# Altium project PCB_Project.PrjPcb
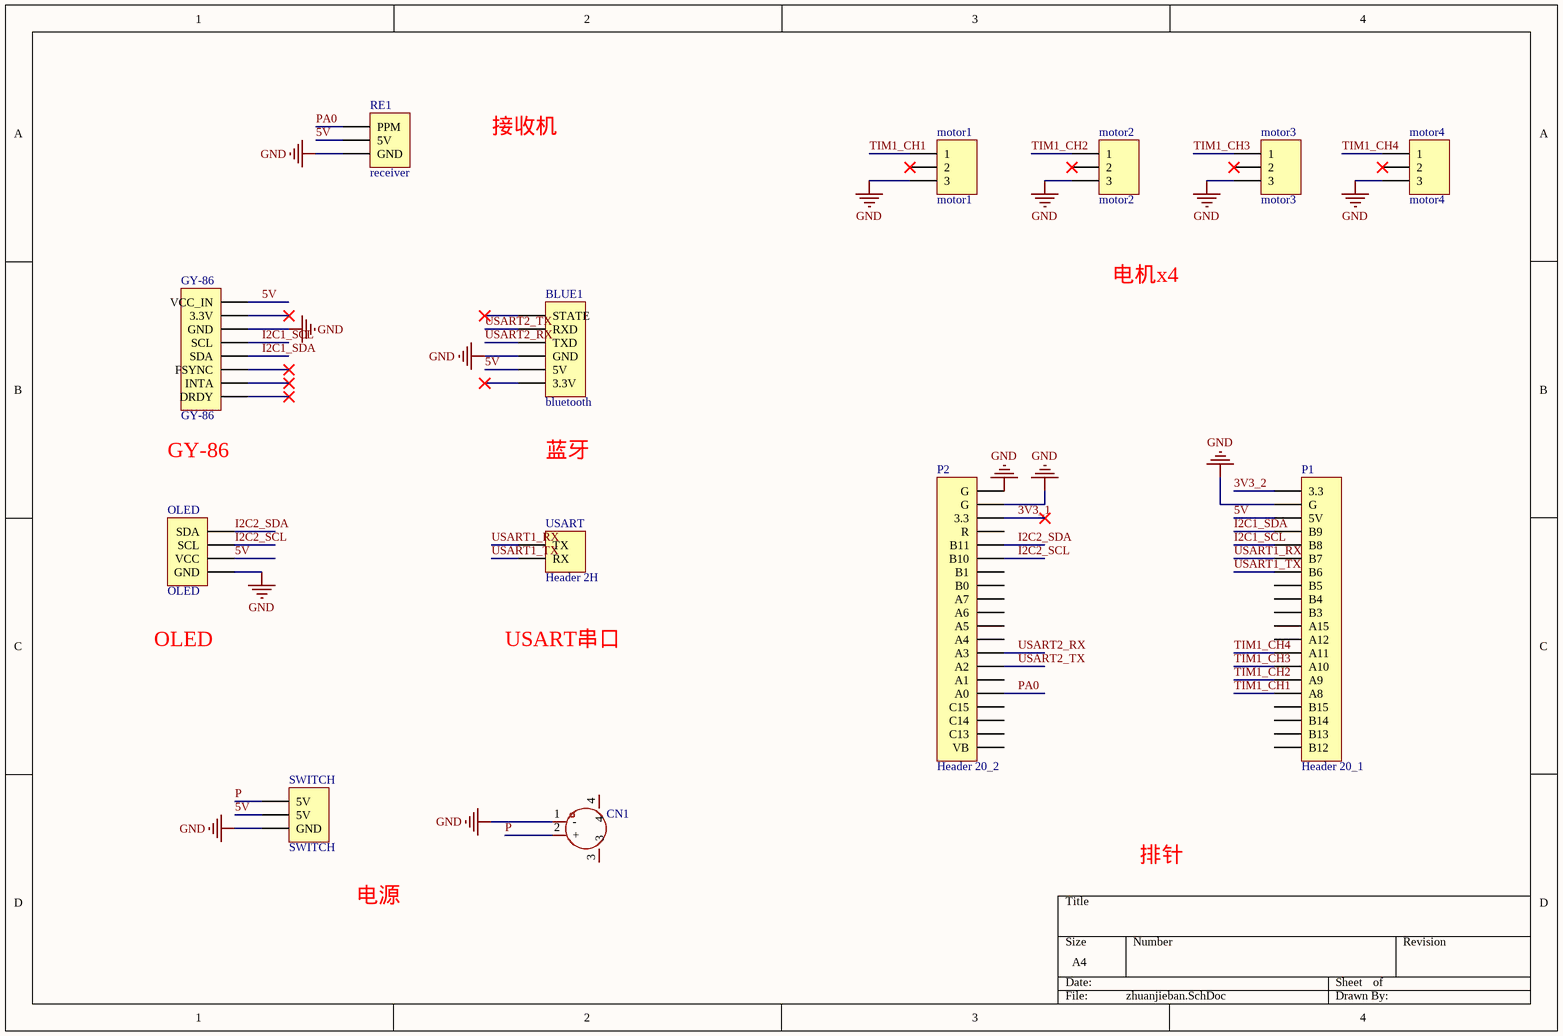
[diagram p0: zhuanjieban.SchDoc]
1 sheet, 13 parts. Net scope: global (net labels, ports and power ports of the same name join across sheets).
Board file: PCB_fin.PcbDoc

## Sheet zhuanjieban.SchDoc
size A4; SheetNumber: 1; SheetTotal: 1

### Parts
BLUE1  bluetooth  [HDR1X6]
CN1  (no value)  [PCBComponent_1]
GY-86  GY-86  [HDR1X8]
motor1  motor1  [HDR1X3]
motor2  motor2  [HDR1X3]
motor3  motor3  [HDR1X3]
motor4  motor4  [HDR1X3]
OLED  OLED  [HDR1X4]
P1  Header 20_1  [HDR1X20]
P2  Header 20_2  [HDR1X20]
RE1  receiver  [HDR1X3]
SWITCH  SWITCH  [HDR1X3]
USART  Header 2H  [HDR1X2H]

### Nets
GND: BLUE1.4(GND) CN1.1(-) GY-86.6(GND) motor1.3 motor2.3 motor3.3 motor4.3 OLED.1(GND) P1.2(G) P2.19(G) P2.20(G) RE1.3(GND) SWITCH.3(GND)
3V3_1: P2.18(3.3)
3V3_2: P1.1(3.3)
5V: BLUE1.5(5V) GY-86.8(VCC_IN) OLED.2(VCC) P1.3(5V) RE1.2(5V) SWITCH.2(5V)
I2C1_SCL: GY-86.5(SCL) P1.5(B8)
I2C1_SDA: GY-86.4(SDA) P1.4(B9)
I2C2_SCL: OLED.3(SCL) P2.15(B10)
I2C2_SDA: OLED.4(SDA) P2.16(B11)
P: CN1.2(+) SWITCH.1(5V)
PA0: P2.5(A0) RE1.1(PPM)
TIM1_CH1: motor1.1 P1.16(A8)
TIM1_CH2: motor2.1 P1.15(A9)
TIM1_CH3: motor3.1 P1.14(A10)
TIM1_CH4: motor4.1 P1.13(A11)
USART1_RX: P1.6(B7) USART.1(TX)
USART1_TX: P1.7(B6) USART.2(RX)
USART2_RX: BLUE1.3(TXD) P2.8(A3)
USART2_TX: BLUE1.2(RXD) P2.7(A2)

Not connected (* = marked no-connect by the designer): BLUE1 1(STATE)* 6(3.3V)*; CN1 3 4; GY-86 1(DRDY)* 2(INTA)* 3(FSYNC)* 7(3.3V)*; motor1 2*; motor2 2*; motor3 2*; motor4 2*; P1 8(B5) 9(B4) 10(B3) 11(A15) 12(A12) 17(B15) 18(B14) 19(B13) 20(B12); P2 1(VB) 2(C13) 3(C14) 4(C15) 6(A1) 9(A4) 10(A5) 11(A6) 12(A7) 13(B0) 14(B1) 17(R)

### Notes on the sheet
- 接收机
- 电机x4
- GY-86
- 蓝牙
- OLED
- USART串口
- 电源
- 排针

### Library data of the parts
BLUE1 = Header 6: Header, 6-Pin; LatestRevisionDate: 17-Jul-2002; LatestRevisionNote: Re-released for DXP Platform.; Publisher: Altium Limited
CN1 = Component_1
GY-86 = Header 8: Header, 8-Pin; LatestRevisionDate: 17-Jul-2002; LatestRevisionNote: Re-released for DXP Platform.; Publisher: Altium Limited
motor1-motor4 RE1 SWITCH = Header 3: Header, 3-Pin; LatestRevisionDate: 17-Jul-2002; LatestRevisionNote: Re-released for DXP Platform.; Publisher: Altium Limited
OLED = Header 4: Header, 4-Pin; LatestRevisionDate: 17-Jul-2002; LatestRevisionNote: Re-released for DXP Platform.; Publisher: Altium Limited
P1 P2 = Header1* 20: LatestRevisionDate: 17-Jul-2002; LatestRevisionNote: Re-released for DXP Platform.; Publisher: Altium Limited
USART = Header 2H: Header, 2-Pin, Right Angle; LatestRevisionDate: 17-Jul-2002; LatestRevisionNote: Re-released for DXP Platform.; Publisher: Altium Limited